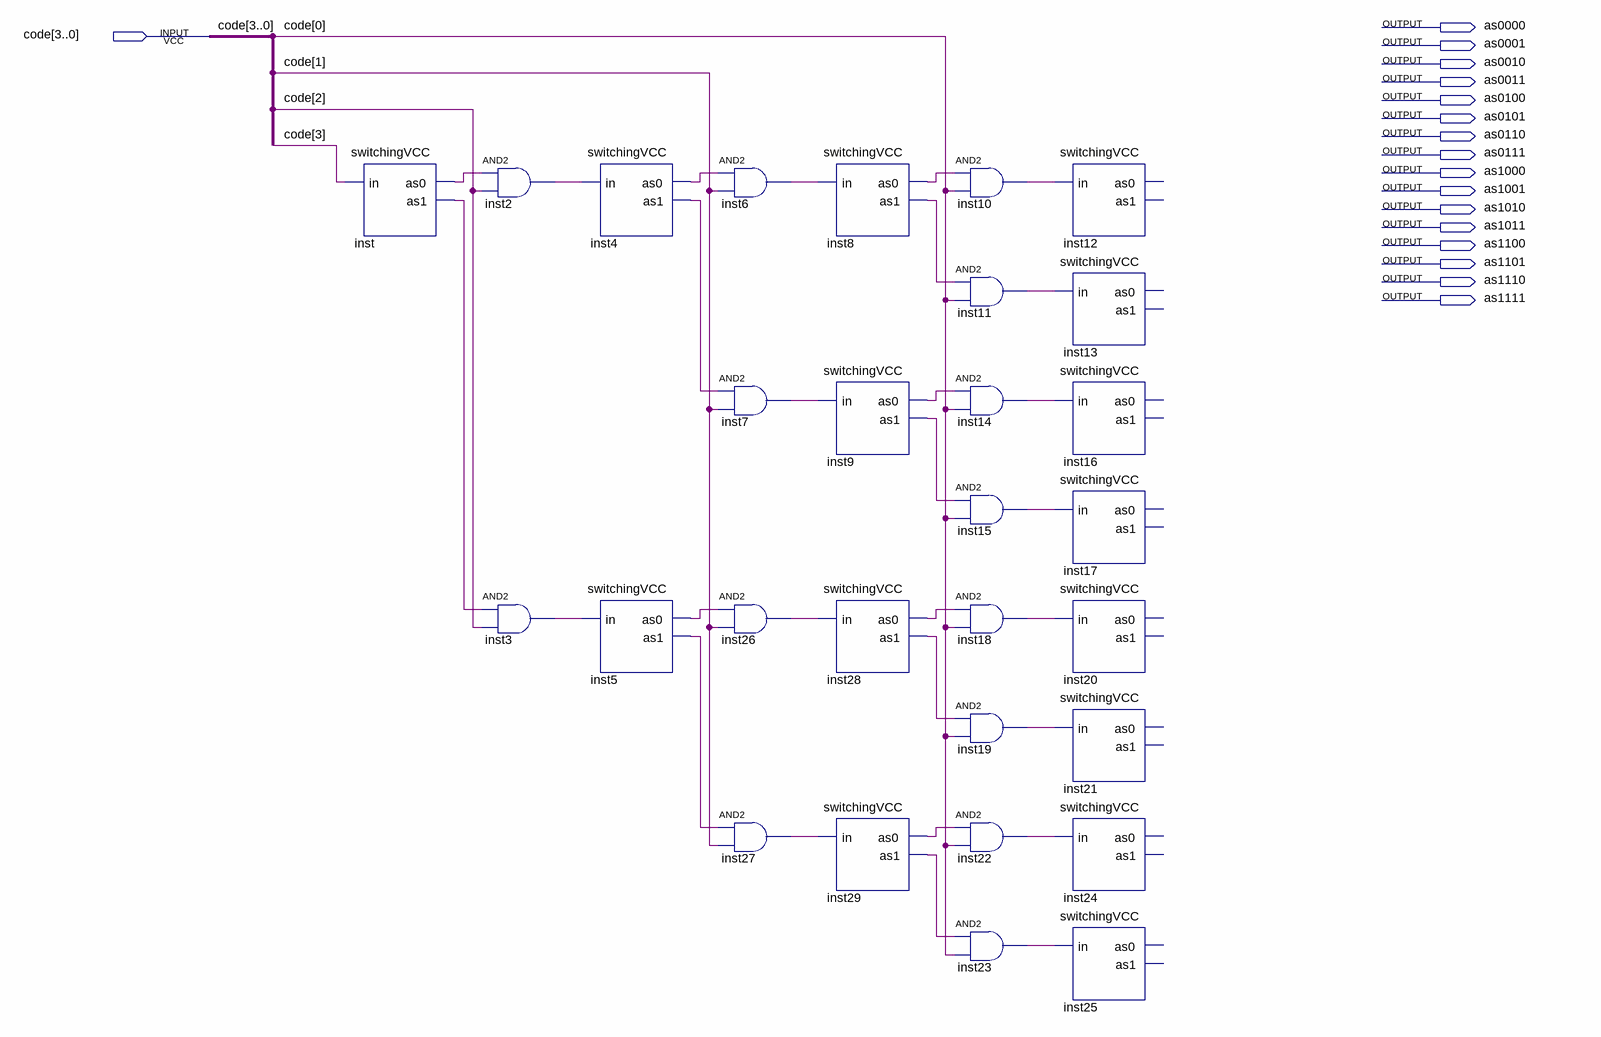
[diagram p0: schematic sheet]
// Quartus schematic 4bit_to_16out.bdf as structural Verilog: 29 symbols, 17 pins
module \4bit_to_16out  (
  input  [3:0] code,
  output as0000,
  output as0001,
  output as0010,
  output as0011,
  output as0100,
  output as0101,
  output as0110,
  output as0111,
  output as1000,
  output as1001,
  output as1010,
  output as1011,
  output as1100,
  output as1101,
  output as1110,
  output as1111
);

  wire inst2_out, inst3_out, inst4_as0, inst4_as1, inst5_as0, inst5_as1, inst6_out, inst7_out, inst8_as0,
       inst8_as1, inst9_as0, inst9_as1, inst10_out, inst11_out, inst14_out, inst15_out, inst18_out,
       inst19_out, inst22_out, inst23_out, inst26_out, inst27_out, inst28_as0, inst28_as1, inst29_as0,
       inst29_as1, inst_as0, inst_as1;

  switchingVCC inst (.in(code[3]), .as0(inst_as0), .as1(inst_as1));
  and inst2 (inst2_out, inst_as0, code[2]);
  and inst3 (inst3_out, inst_as1, code[2]);
  switchingVCC inst4 (.in(inst2_out), .as0(inst4_as0), .as1(inst4_as1));
  switchingVCC inst5 (.in(inst3_out), .as0(inst5_as0), .as1(inst5_as1));
  and inst6 (inst6_out, inst4_as0, code[1]);
  and inst7 (inst7_out, inst4_as1, code[1]);
  and inst26 (inst26_out, inst5_as0, code[1]);
  and inst27 (inst27_out, inst5_as1, code[1]);
  switchingVCC inst8 (.in(inst6_out), .as0(inst8_as0), .as1(inst8_as1));
  switchingVCC inst9 (.in(inst7_out), .as0(inst9_as0), .as1(inst9_as1));
  switchingVCC inst28 (.in(inst26_out), .as0(inst28_as0), .as1(inst28_as1));
  switchingVCC inst29 (.in(inst27_out), .as0(inst29_as0), .as1(inst29_as1));
  and inst10 (inst10_out, inst8_as0, code[0]);
  and inst11 (inst11_out, inst8_as1, code[0]);
  and inst14 (inst14_out, inst9_as0, code[0]);
  and inst15 (inst15_out, inst9_as1, code[0]);
  and inst18 (inst18_out, inst28_as0, code[0]);
  and inst19 (inst19_out, inst28_as1, code[0]);
  and inst22 (inst22_out, inst29_as0, code[0]);
  and inst23 (inst23_out, inst29_as1, code[0]);
  switchingVCC inst12 (.in(inst10_out));  // open: as0, as1
  switchingVCC inst13 (.in(inst11_out));  // open: as0, as1
  switchingVCC inst16 (.in(inst14_out));  // open: as0, as1
  switchingVCC inst17 (.in(inst15_out));  // open: as0, as1
  switchingVCC inst20 (.in(inst18_out));  // open: as0, as1
  switchingVCC inst21 (.in(inst19_out));  // open: as0, as1
  switchingVCC inst24 (.in(inst22_out));  // open: as0, as1
  switchingVCC inst25 (.in(inst23_out));  // open: as0, as1
endmodule
